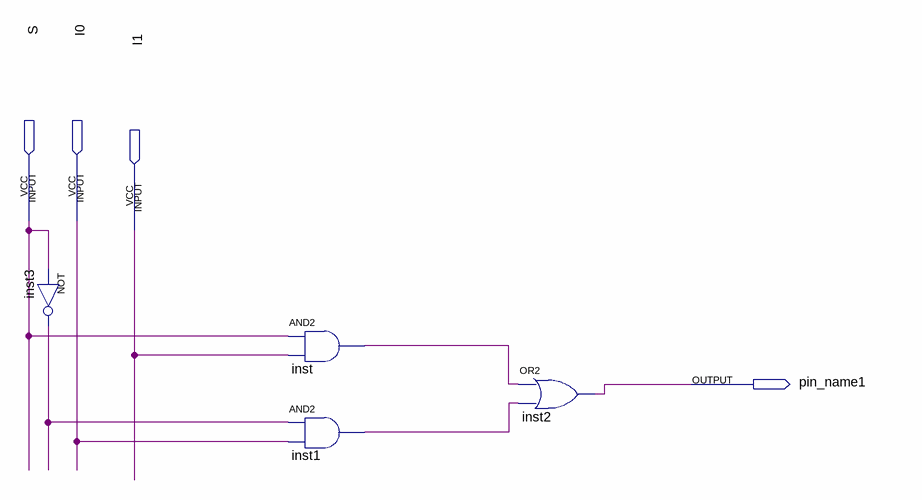
[diagram p0: schematic sheet]
// Quartus schematic Mux2_1.bdf as structural Verilog: 4 symbols, 4 pins
module Mux2_1 (
  input  S,
  input  I0,
  input  I1,
  output pin_name1
);

  wire inst1_out, inst3_out, inst_out;

  not inst3 (inst3_out, S);
  and inst (inst_out, S, I1);
  and inst1 (inst1_out, inst3_out, I0);
  or inst2 (pin_name1, inst_out, inst1_out);
endmodule
